# Altium schematic sheet VoltageBooster48V.SchDoc
size A; SheetNumber: 4; SheetTotal: 4
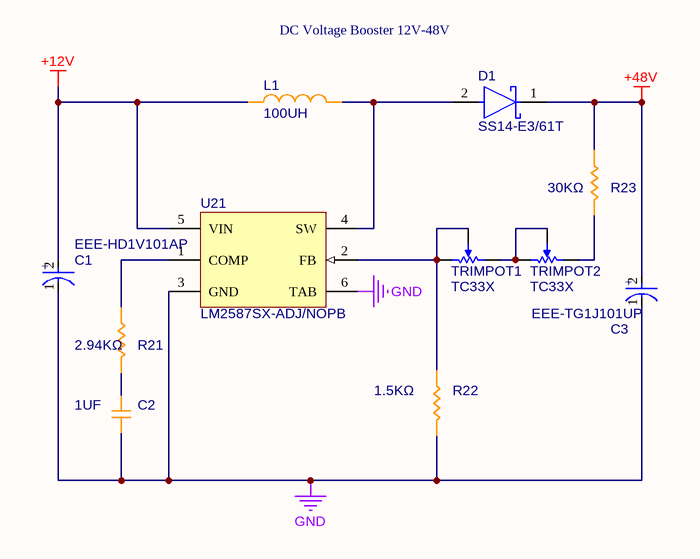
[diagram p0: VoltageBooster48V.SchDoc]

## Parts
C1  EEE-HD1V101AP  [FP-HDG-MFG]
C2  1UF  [CAP_0603]
C3  EEE-TG1J101UP  [FP-TGG-MFG]
D1  SS14-E3/61T  [FP-95400-MFG]
L1  100UH  [IND_Boost]
R21  2.94KΩ  [RES_0603]
R22  1.5KΩ  [RES_0603]
R23  30KΩ  [RES_0603]
TRIMPOT1  TC33X  [BOUR-TC33X-2_V]
TRIMPOT2  TC33X  [BOUR-TC33X-2_V]
U21  LM2587SX-ADJ/NOPB  [KTT0005B_N]

## Nets
+12V: C1.2(A) L1.1 U21.5(VIN)
+48V: C3.2(A) D1.1(C) R23.2
GND: C1.1(C) C2.1 C3.1(C) R22.1 U21.3(GND) U21.6(TAB)
NetC2_2: C2.2 R21.1
NetD1_2: D1.2(A) L1.2 U21.4(SW)
NetR21_2: R21.2 U21.1(COMP)
NetR22_2: R22.2 TRIMPOT1.1 TRIMPOT1.2 U21.2(FB)
NetR23_1: R23.1 TRIMPOT2.3
NetTRIMPOT1_3: TRIMPOT1.3 TRIMPOT2.1 TRIMPOT2.2

## Notes on the sheet
- DC Voltage Booster 12V-48V
- (in symbol CMP-00287-42869300-1) +
- (in symbol CMP-05427-002169-1) +

## Library data of the parts
C1 = CMP-00287-42869300-1: EEE-HD1V101AP Aluminum Electrolytic Capacitor, 100 uF, 35 V, ± 20%, 5000 hours @ 105°C, Radial Can - SMD; Voltage: 35V; ESR (Equivalent Series Resistance): 800mΩ; Ripple Current (AC): 101mA; Leakage Current: 35µA; Dissipation Factor: 14%; Dielectric Material: Aluminium; Capacitance: 100µF; Lifecycle Status: Production; Life (Hours): 5000hours; Tolerance: 20%; Height - Seated (Max): 10.2108mm; Number of Pins: 2; Length: 10.5mm; REACH SVHC: No SVHC; Min Operating Temperature: -40°C; Mount: PCB, Surface Mount; Lead Pitch: 4.6mm; Voltage Rating (DC): 35V; Lead Free: Lead Free; RoHS: Compliant; Ripple Current: 101mA; Height: 10.2mm; Termination: SMD/SMT; NexarPartId: 42869300; Packaging: Cut Tape; Radiation Hardening: No; Case/Package: Radial; Voltage Rating: 35V; Schedule B: 8532220020, 8532220020; Diameter: 10mm; Max Operating Temperature: 105°C; Impedance: 800mΩ
C2 = CAP_0603: Capacitor SMD 0603 generic
C3 = CMP-05427-002169-1: CAP ALUM 100UF 20% 63V SMD; ESR (Equivalent Series Resistance): 800mR; Ripple Current: 150mA; Dissipation Factor: 0.12%; Life (Hours): 2000Hour; Package Quantity: 500; Series: TG; Height: 10.2mm; Construction: Cylindrical; Lead Free: Lead Free; Ratings: AEC-Q200; Mount: Surface Mount; Termination: SMD/SMT; Case/Package: Radial; Length: 10.2mm; Diameter: 10mm; Height - Seated (Max): 0.402inch; Reach SVHC Compliant: Yes; Capacitance: 100uF; Packaging: Tape and Reel; Max Operating Temperature: 125°C; Voltage: 63V; RoHS Compliant: Yes; Tolerance: 20%; Min Operating Temperature: -40°C; Voltage Rating: 63V; Width: 900um; Ripple Current (AC): 150mA; Voltage Rating (DC): 63V; Contact Plating: Tin; Radiation Hardening: No
D1 = CMP-02539-000035-1: DIODE SCHOTTKY 40V 1A DO214AC; Manufacturer: Vishay; Peak Reverse Current: 0.2mA; Standoff Height: 0mm; Max Junction Temp: +150°C; Max Surge Forward Current: 40A; RoHS: TRUE; Digikey Description: DIODE SCHOTTKY 40V 1A DO214AC; Category: Diode; Device Class L3: Schottky Diodes; Temperature Range High: +150°C; Automotive: No; Temperature: -65°C to +150°C; Device Class L2: Diodes; Forward Current: 1A; Temperature Range Low: -65°C; Footprint Url: http://www.vishay.com/docs/95400/sma.pdf; Octopart: https://octopart.com/ss14-e3%2F61t-vishay-39552847; Package: 95400; Max Repetitive Reverse Voltage: 40V; ComponentLink2Description: Datasheet; ComponentLink2URL: http://www.vishay.com/docs/88746/ss12.pdf; Lead Free: Yes; Height: 2.29mm; Mouser Description: SS14 Series 40 V 1 A Surface Mount Schottky Barrier Rectifier - DO-214AC (SMA); Manufacturer Part Number: SS14-E3/61T; Device Class L1: Discrete Semiconductors
L1 = Boost Inductor: Voltage Boost Inductor
R21-R23 = RES_0603: Resistor SMD 0603 generic
TRIMPOT1 TRIMPOT2 = CMP-2100-03695-1: Trimming Potentiometer, 10000 Ohm, -40 to 100 degC, 3-Pin SMD, RoHS, Tape and Reel; Manufacturer: Bourns; Tolerance: 25%; Max Power Dissipation: 100mW; Number of Turns: 1; Resistance: 10KOhm; Temperature Coefficient: 250ppm/degreesC; Voltage Rating (DC): 50V; Datasheet URL: http://www.bourns.com/docs/Product-Datasheets/TC33.pdf; Composition: Potentiometer; Package Description: 3-Pin Surface Mount Device, Body 3.8 x 3.6 mm; Weight: 29.4mg; Power Rating: 100mW; Termination: FootPrint; Manufacturer URL: http://www.bourns.com/; Width: 0.118inch; Height: 0.047inch; Military Standard: Not; Radiation Hardening: No; Colour: Silver; Case/Package: SMD/SMT; Depth: 3.8mm; Min Operating Temperature: -40degC; Lead Free: LeadFree; Datasheet Version: 42583.0; REACH SVHC: NoSVHC; Length: 3mm; RoHSCompliant: true; Contact Plating: Silver; Taper: Linear; Packaging: TapeandReel; Mount: SurfaceMount; Max Operating Temperature: 100degC; Package Reference: TC33X-2; Package Quantity: 2500
U21 = CMP-0069-00069-3: 5A Flyback Regulator, 5-pin TO-263, Pb-Free; Manufacturer: Texas Instruments; PowerWise: N; CompType: Switcher; PackageTopMarking: NSUZXYTTE#*LM2587S*-ADJ P+; PackageDescription: TO-263, Molded, .400 x .390 x .180in, 5 Lead, .067in Pitch, Surface Mount; ComponentLink1URL: http://www.ti.com/general/docs/lit/getliterature.tsp?genericPartNumber=LM2587&fileType=pdf; Code_JEDEC: MO-169-AB; PinCount: 5; PackageReference: KTT0005B; ComponentLink1Description: Datasheet URL; RoHS: Y